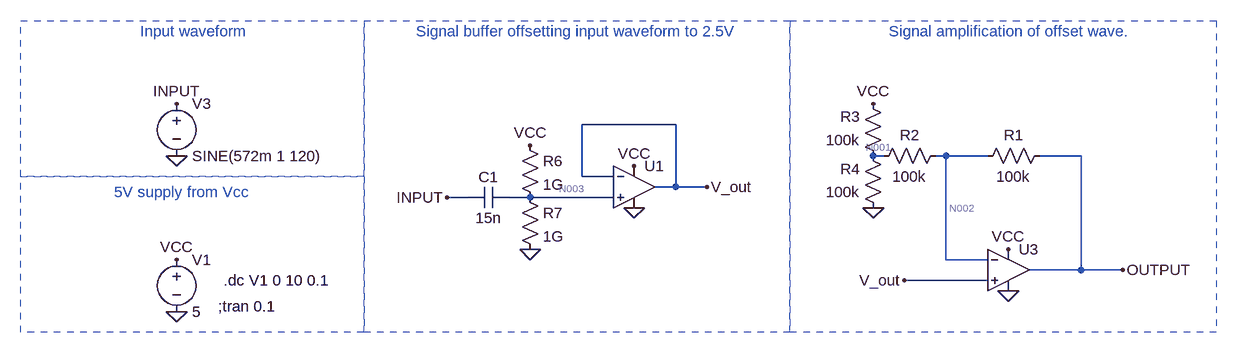
[diagram p0: schematic 301PossibleDesign.asc]
301PossibleDesign.asc, the LTspice schematic file:
Version 4
SHEET 1 1700 680
WIRE -1552 -464 -1696 -464
WIRE -1232 -416 -1248 -416
WIRE -1136 -416 -1152 -416
WIRE -1072 -416 -1136 -416
WIRE -928 -416 -992 -416
WIRE -1696 -384 -1696 -464
WIRE -1648 -384 -1696 -384
WIRE -1552 -368 -1552 -464
WIRE -1552 -368 -1584 -368
WIRE -1504 -368 -1552 -368
WIRE -1872 -352 -1904 -352
WIRE -1776 -352 -1808 -352
WIRE -1648 -352 -1776 -352
WIRE -1136 -256 -1136 -416
WIRE -1072 -256 -1136 -256
WIRE -928 -240 -928 -416
WIRE -928 -240 -1008 -240
WIRE -864 -240 -928 -240
WIRE -1072 -224 -1200 -224
FLAG -2320 -256 VCC
FLAG -2320 -416 0
FLAG -1616 -400 VCC
FLAG -1616 -336 0
FLAG -1776 -272 0
FLAG -1776 -432 VCC
FLAG -864 -240 OUTPUT
FLAG -1040 -272 VCC
FLAG -1040 -208 0
FLAG -2320 -176 0
FLAG -1248 -496 VCC
FLAG -2320 -496 INPUT
FLAG -1904 -352 INPUT
FLAG -1504 -368 V_out
FLAG -1200 -224 V_out
FLAG -1248 -336 0
SYMBOL voltage -2320 -512 R0
WINDOW 123 0 0 Left 2
WINDOW 39 0 0 Left 2
SYMATTR InstName V3
SYMATTR Value SINE(572m 1 120)
SYMBOL res -1792 -448 R0
SYMATTR InstName R6
SYMATTR Value 1G
SYMBOL res -1792 -368 R0
SYMATTR InstName R7
SYMATTR Value 1G
SYMBOL cap -1808 -368 R90
WINDOW 0 0 32 VBottom 2
WINDOW 3 32 32 VTop 2
SYMATTR InstName C1
SYMATTR Value 15n
SYMBOL res -976 -432 R90
WINDOW 0 0 56 VBottom 2
WINDOW 3 32 56 VTop 2
SYMATTR InstName R1
SYMATTR Value 100k
SYMBOL res -1248 -400 R270
WINDOW 0 32 56 VTop 2
WINDOW 3 0 56 VBottom 2
SYMATTR InstName R2
SYMATTR Value 100k
SYMBOL Opamps\\UniversalOpamp2 -1040 -240 R0
SYMATTR InstName U3
SYMBOL voltage -2320 -272 R0
WINDOW 123 0 0 Left 2
WINDOW 39 0 0 Left 2
SYMATTR InstName V1
SYMATTR Value 5
SYMBOL res -1232 -400 R180
WINDOW 0 36 76 Left 2
WINDOW 3 36 40 Left 2
SYMATTR InstName R3
SYMATTR Value 100k
SYMBOL res -1232 -320 R180
WINDOW 0 36 76 Left 2
WINDOW 3 36 40 Left 2
SYMATTR InstName R4
SYMATTR Value 100k
SYMBOL Opamps\\UniversalOpamp2 -1616 -368 R0
SYMATTR InstName U1
TEXT -2256 -184 Left 2 !;tran 0.1
TEXT -2376 -608 Left 2 ;Input waveform
TEXT -2416 -360 Left 2 ;5V supply from Vcc
TEXT -1952 -608 Left 2 ;Signal buffer offsetting input waveform to 2.5V
TEXT -1224 -608 Left 2 ;Signal amplification of offset wave.
TEXT -2248 -224 Left 2 !.dc V1 0 10 0.1
RECTANGLE Normal -2032 -384 -2560 -624 1
RECTANGLE Normal -2032 -144 -2560 -384 1
RECTANGLE Normal -1376 -144 -2032 -624 1
RECTANGLE Normal -720 -144 -1376 -624 1

The netlist it stands for:
* 301PossibleDesign.asc
V3 INPUT 0 SINE(572m 1 120)
R6 VCC N003 1G
R7 N003 0 1G
C1 N003 INPUT 15n
R1 OUTPUT N002 100k
R2 N001 N002 100k
XU3 V_out N002 VCC 0 OUTPUT level.2 Avol=1Meg GBW=10Meg Slew=10Meg ilimit=25m rail=0 Vos=0 phimargin=45 en=0 enk=0 in=0 ink=0 Rin=500Meg  ; pins IN+ IN- V+ V- OUT
V1 VCC 0 5
R3 N001 VCC 100k
R4 0 N001 100k
XU1 N003 V_out VCC 0 V_out level.2 Avol=1Meg GBW=10Meg Slew=10Meg ilimit=25m rail=0 Vos=0 phimargin=45 en=0 enk=0 in=0 ink=0 Rin=500Meg  ; pins IN+ IN- V+ V- OUT
;tran 0.1
* Input waveform
* 5V supply from Vcc
* Signal buffer offsetting input waveform to 2.5V
* Signal amplification of offset wave.
.dc V1 0 10 0.1
.lib UniversalOpamps2.sub
.backanno
.end

* Results of the author's LTspice run, read from the files saved beside the schematic
* Operating Point, zero values left out:
*   V(input) = 572 mV
*   V(vcc) = 5 V
*   V(n003) = 2.5 V
*   V(output) = 2.5 V
*   V(n002) = 2.5 V
*   V(n001) = 2.5 V
*   V(v_out) = 2.5 V
*   I(R4) = -25 µA
*   I(R3) = -25 µA
*   I(R7) = 2.5 nA
*   I(R6) = 2.5 nA
*   I(V1) = -525 µA
*   Ix(u3:3) = 250 µA
*   Ix(u3:4) = -250 µA
*   Ix(u3:5) = 198.3 pA
*   Ix(u1:3) = 250 µA
*   Ix(u1:4) = -250 µA
*   Ix(u1:5) = 216 pA
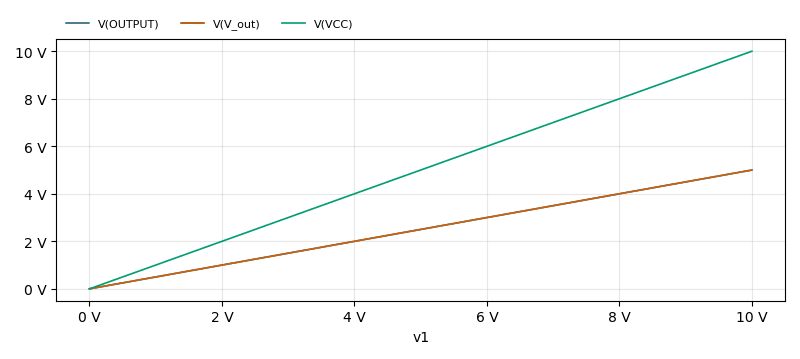
[diagram p1: DC transfer characteristic of 301PossibleDesign.asc, plotted from the saved traces]
* DC transfer characteristic, 1 run:
*   V(OUTPUT): 0 V at v1=0 V, 5 V at v1=10 V, min 0 V, max 5 V
*   V(V_out): 0 V at v1=0 V, 5 V at v1=10 V, min 0 V, max 5 V
*   V(VCC): 0 V at v1=0 V, 10 V at v1=10 V, min 0 V, max 10 V